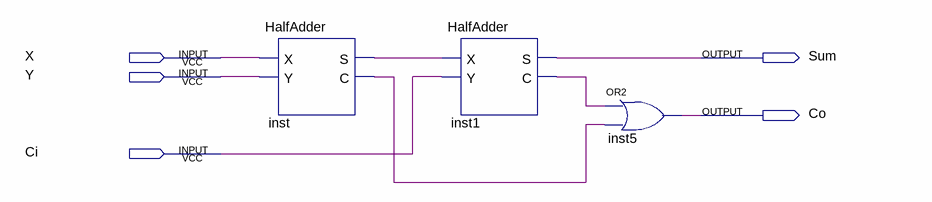
[diagram p0: schematic sheet]
// Quartus schematic FullAdder.bdf as structural Verilog: 3 symbols, 5 pins
module FullAdder (
  input  X,
  input  Y,
  input  Ci,
  output Sum,
  output Co
);

  wire inst1_c, inst_c, inst_s;

  HalfAdder inst (.X(X), .Y(Y), .S(inst_s), .C(inst_c));
  HalfAdder inst1 (.X(inst_s), .Y(Ci), .S(Sum), .C(inst1_c));
  or inst5 (Co, inst1_c, inst_c);
endmodule
